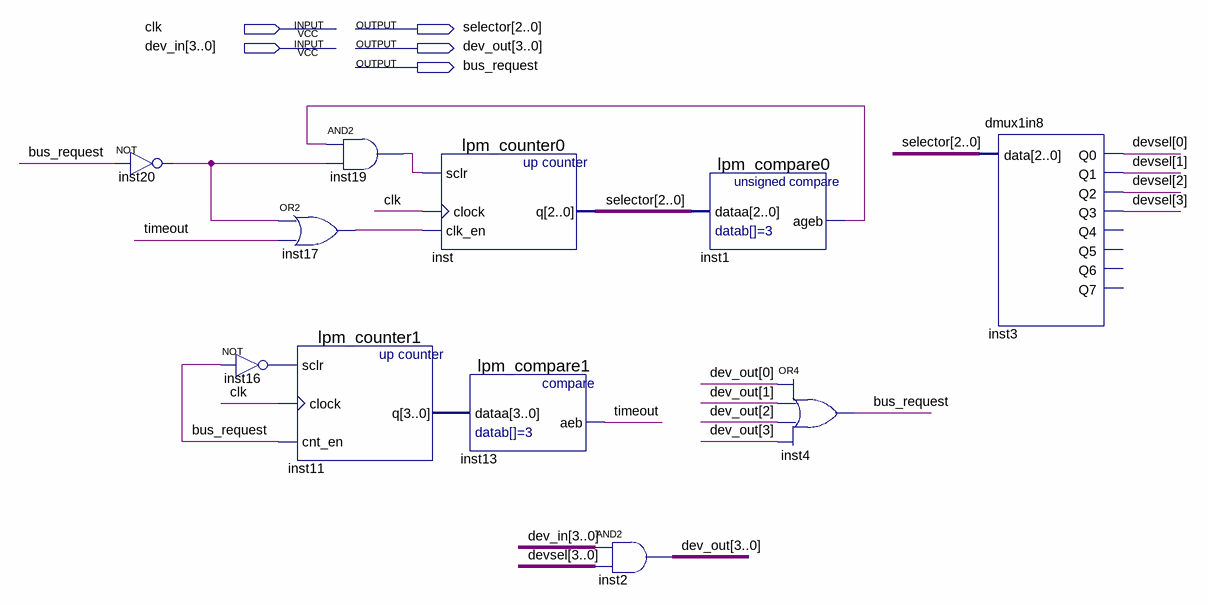
[diagram p0: schematic sheet]
// Quartus schematic Controller.bdf as structural Verilog: 11 symbols, 5 pins
module Controller (
  input  clk,
  input  [3:0] dev_in,
  output [2:0] selector,
  output [3:0] dev_out,
  output bus_request
);

  wire inst1_ageb, inst16_out, inst17_out, inst19_out, inst20_out, timeout;
  wire [3:0] devsel, inst11_q;

  not inst20 (inst20_out, bus_request);
  or inst17 (inst17_out, inst20_out, timeout);
  lpm_counter1 inst11 (.sclr(inst16_out), .clock(clk), .cnt_en(bus_request), .q(inst11_q));
  not inst16 (inst16_out, bus_request);
  and inst19 (inst19_out, inst1_ageb, inst20_out);
  lpm_counter0 inst (.sclr(inst19_out), .clock(clk), .clk_en(inst17_out), .q(selector));
  lpm_compare1 inst13 (.dataa(inst11_q), .aeb(timeout));
  assign dev_out = dev_in & devsel;  // AND2 inst2, 4 bits wide
  lpm_compare0 inst1 (.dataa(selector), .ageb(inst1_ageb));
  or inst4 (bus_request, dev_out[0], dev_out[1], dev_out[2], dev_out[3]);
  dmux1in8 inst3 (
    .data(selector), .Q0(devsel[0]), .Q1(devsel[1]), .Q2(devsel[2]), .Q3(devsel[3]));  // open: Q4, Q5, Q6, Q7
endmodule
